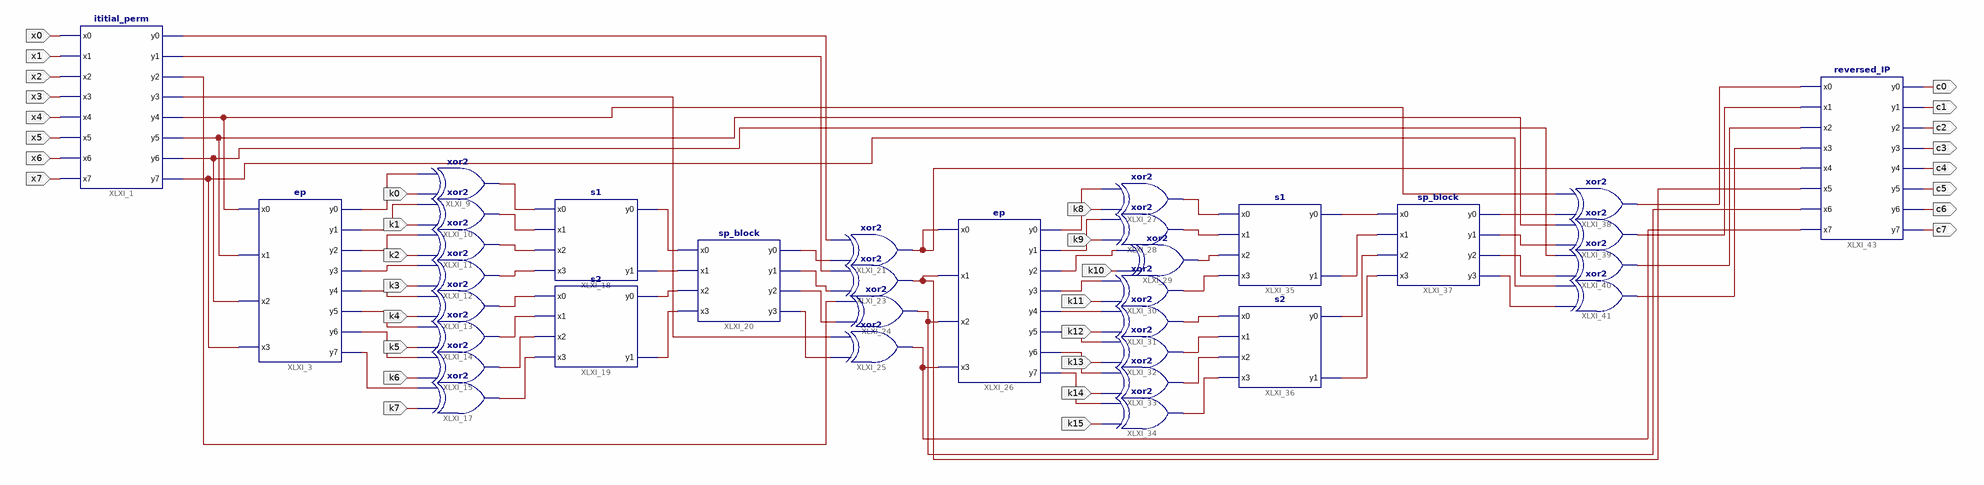
[diagram p0: schematic sheet 1]
// Xilinx ISE schematic des_sch.sch (xc9500) as structural Verilog: 34 symbols, 32 ports
module des_sch (
  input  x0,
  input  x1,
  input  x2,
  input  x3,
  input  x4,
  input  x5,
  input  x6,
  input  x7,
  input  k0,
  input  k1,
  input  k2,
  input  k3,
  input  k4,
  input  k5,
  input  k6,
  input  k7,
  input  k8,
  input  k9,
  input  k10,
  input  k11,
  input  k12,
  input  k13,
  input  k14,
  input  k15,
  output c0,
  output c1,
  output c2,
  output c3,
  output c4,
  output c5,
  output c6,
  output c7
);

  wire XLXN_1, XLXN_2, XLXN_4, XLXN_42, XLXN_43, XLXN_44, XLXN_45, XLXN_46, XLXN_47, XLXN_48, XLXN_50,
       XLXN_59, XLXN_60, XLXN_61, XLXN_62, XLXN_63, XLXN_64, XLXN_65, XLXN_66, XLXN_67, XLXN_68, XLXN_69,
       XLXN_70, XLXN_79, XLXN_80, XLXN_81, XLXN_105, XLXN_106, XLXN_108, XLXN_109, XLXN_110, XLXN_111,
       XLXN_112, XLXN_122, XLXN_128, XLXN_129, XLXN_130, XLXN_131, XLXN_132, XLXN_133, XLXN_134, XLXN_135,
       XLXN_136, XLXN_137, XLXN_138, XLXN_139, XLXN_144, XLXN_145, XLXN_146, XLXN_147, XLXN_190, XLXN_191,
       XLXN_192, XLXN_198, XLXN_199, XLXN_200, XLXN_201, XLXN_202, XLXN_203, XLXN_204, XLXN_205, XLXN_206,
       XLXN_207, XLXN_208;

  ititial_perm XLXI_1 (
    .x0(x0), .x1(x1), .x2(x2), .x3(x3), .x4(x4), .x5(x5), .x6(x6), .x7(x7), .y0(XLXN_1), .y1(XLXN_2),
    .y2(XLXN_199), .y3(XLXN_4), .y4(XLXN_198), .y5(XLXN_192), .y6(XLXN_191), .y7(XLXN_190));
  ep XLXI_3 (
    .x0(XLXN_198), .x1(XLXN_192), .x2(XLXN_191), .x3(XLXN_190), .y0(XLXN_42), .y1(XLXN_43), .y2(XLXN_44),
    .y3(XLXN_45), .y4(XLXN_46), .y5(XLXN_47), .y6(XLXN_48), .y7(XLXN_50));
  xor XLXI_9 (XLXN_59, k0, XLXN_42);
  xor XLXI_10 (XLXN_60, k1, XLXN_43);
  xor XLXI_11 (XLXN_61, k2, XLXN_44);
  xor XLXI_12 (XLXN_62, k3, XLXN_45);
  xor XLXI_13 (XLXN_63, k4, XLXN_46);
  xor XLXI_14 (XLXN_64, k5, XLXN_47);
  xor XLXI_15 (XLXN_65, k6, XLXN_48);
  xor XLXI_17 (XLXN_66, k7, XLXN_50);
  s1 XLXI_18 (.x0(XLXN_59), .x1(XLXN_60), .x2(XLXN_61), .x3(XLXN_62), .y0(XLXN_70), .y1(XLXN_69));
  s2 XLXI_19 (.x0(XLXN_63), .x1(XLXN_64), .x2(XLXN_65), .x3(XLXN_66), .y0(XLXN_68), .y1(XLXN_67));
  sp_block XLXI_20 (
    .x0(XLXN_70), .x1(XLXN_69), .x2(XLXN_68), .x3(XLXN_67), .y0(XLXN_79), .y1(XLXN_200), .y2(XLXN_80),
    .y3(XLXN_81));
  xor XLXI_21 (XLXN_205, XLXN_79, XLXN_1);
  xor XLXI_23 (XLXN_206, XLXN_200, XLXN_2);
  xor XLXI_24 (XLXN_207, XLXN_80, XLXN_199);
  xor XLXI_25 (XLXN_208, XLXN_81, XLXN_4);
  ep XLXI_26 (
    .x0(XLXN_205), .x1(XLXN_206), .x2(XLXN_207), .x3(XLXN_208), .y0(XLXN_105), .y1(XLXN_106), .y2(XLXN_122),
    .y3(XLXN_108), .y4(XLXN_109), .y5(XLXN_110), .y6(XLXN_111), .y7(XLXN_112));
  xor XLXI_27 (XLXN_128, k8, XLXN_105);
  xor XLXI_28 (XLXN_129, k9, XLXN_106);
  xor XLXI_29 (XLXN_130, k10, XLXN_122);
  xor XLXI_30 (XLXN_131, k11, XLXN_108);
  xor XLXI_31 (XLXN_132, k12, XLXN_109);
  xor XLXI_32 (XLXN_133, k13, XLXN_110);
  xor XLXI_33 (XLXN_134, k14, XLXN_111);
  xor XLXI_34 (XLXN_135, k15, XLXN_112);
  s1 XLXI_35 (.x0(XLXN_128), .x1(XLXN_129), .x2(XLXN_130), .x3(XLXN_131), .y0(XLXN_136), .y1(XLXN_137));
  s2 XLXI_36 (.x0(XLXN_132), .x1(XLXN_133), .x2(XLXN_134), .x3(XLXN_135), .y0(XLXN_138), .y1(XLXN_139));
  sp_block XLXI_37 (
    .x0(XLXN_136), .x1(XLXN_137), .x2(XLXN_138), .x3(XLXN_139), .y0(XLXN_144), .y1(XLXN_145), .y2(XLXN_146),
    .y3(XLXN_147));
  xor XLXI_38 (XLXN_201, XLXN_144, XLXN_198);
  xor XLXI_39 (XLXN_202, XLXN_145, XLXN_192);
  xor XLXI_40 (XLXN_203, XLXN_146, XLXN_191);
  xor XLXI_41 (XLXN_204, XLXN_147, XLXN_190);
  reversed_IP XLXI_43 (
    .x0(XLXN_201), .x1(XLXN_202), .x2(XLXN_203), .x3(XLXN_204), .x4(XLXN_205), .x5(XLXN_206), .x6(XLXN_207),
    .x7(XLXN_208), .y0(c0), .y1(c1), .y2(c2), .y3(c3), .y4(c4), .y5(c5), .y6(c6), .y7(c7));
endmodule
